# EAGLE design MPL_Breakout (EAGLE 9.5.2)
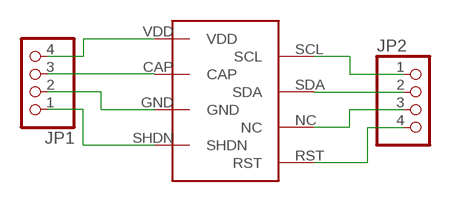
[diagram p0: schematic, sheet 1]

## Parts
B1  MPL115A2T1  [MPL115A2T1]
JP1  PINHD-1X4  [1X04]
JP2  PINHD-1X4  [1X04]

## Nets
N$1: B1.VDD JP1.4
N$2: B1.CAP JP1.3
N$3: B1.GND JP1.2
N$4: B1.SHDN JP1.1
N$5: B1.RST JP2.4
N$6: B1.NC JP2.3
N$7: B1.SDA JP2.2
N$8: B1.SCL JP2.1

## Library data of the parts
B1 = MPL115A2T1:MPL115A2T1: MEMS Barometer from NXP Semiconductors. DATASHEET: https://www.nxp.com/docs/en/data-sheet/MPL115A2.pdf
JP1 JP2 = pinhead:PINHD-1X4: PIN HEADER

## Board
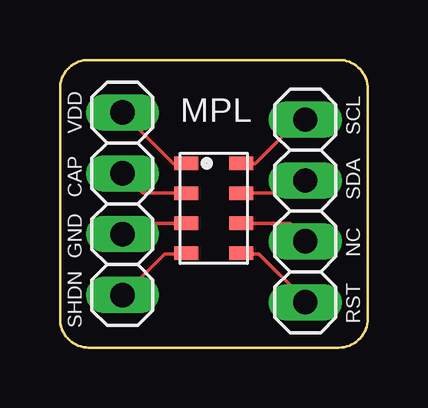
[diagram p1: board, top side]

Size 12.82 x 12 mm. Coordinates in mm from the lower left corner, seen from the top.
Outline: 12.82,1.2 12.82,10.8 arc90 11.62,12 1.2,12 arc90 0,10.8 0,1.2 arc90 1.2,0 11.62,0 arc90 12.82,1.2
Copper layers (1*16): Top 0.035mm / dielectric 1.5mm / Bottom 0.035mm
Design rules "default": minimum track width 6mil, minimum drill 0.35mm, track to track 6mil, track to pad 6mil, pad to pad 6mil, via to via 6mil, smd to smd 6mil, copper to edge 40mil, drill to drill 6mil, minimum pad ring 10mil, minimum via ring 8mil, stop-mask expansion 4mil, vias tented up to drill 0mil, thermal gap 10mil

### Footprints (pad centres in the part's own frame; a part is rotated, then mirrored left to right if it is on the bottom)
MPL115A2T1 = smd 1 x 0.55: CAP -1.15,0.625; GND -1.15,-0.625; NC 1.15,-0.625; RST 1.15,-1.875; SCL 1.15,1.875; SDA 1.15,0.625; SHDN -1.15,-1.875; VDD -1.15,1.875
1X04 = drill 1.016 long: 1 -3.81,0; 2 -1.27,0; 3 1.27,0; 4 3.81,0

### Placement (x,y rotation side)
B1  6.41,5.81 0 top
JP1  2.6,6 90 top
JP2  10.22,5.7 270 top

### Tracks (layer width: path | path; a pad name or v marks a point on that pad's centre or on a via)
N$1
  Top 0.152: B1.VDD 5.25,7.67 4.72,7.67 2.6,9.8 JP1.4
N$2
  Top 0.152: B1.CAP 5.25,6.45 3.45,6.45 2.74,7.16 JP1.3
N$3
  Top 0.152: B1.GND 5.18,5.18 3.05,5.18 2.74,4.88 JP1.2
N$4
  Top 0.152: B1.SHDN 5.24,3.91 4.37,3.91 2.74,2.29 JP1.1
N$5
  Top 0.152: B1.RST 7.57,3.91 8.28,3.91 10.21,1.98 JP2.4
N$6
  Top 0.152: B1.NC 7.62,5.18 9.6,5.18 10.21,4.57 JP2.3
N$7
  Top 0.152: B1.SDA 7.57,6.45 9.81,6.45 10.21,6.86 JP2.2
N$8
  Top 0.152: B1.SCL 7.57,7.67 8.13,7.67 9.97,9.51 JP2.1

### Text on the board
tNames: VDD | SCL | MPL | CAP | SDA | GND | NC | SHDN | RST